# Altium schematic sheet Э3_2.SchDoc: плата
size 420 x 297 mm; DrawnBy: Каверзнев; DocumentNumber: Ремонт Труб; Revision: 1; SheetNumber: 1; SheetTotal: 2; Format: A3
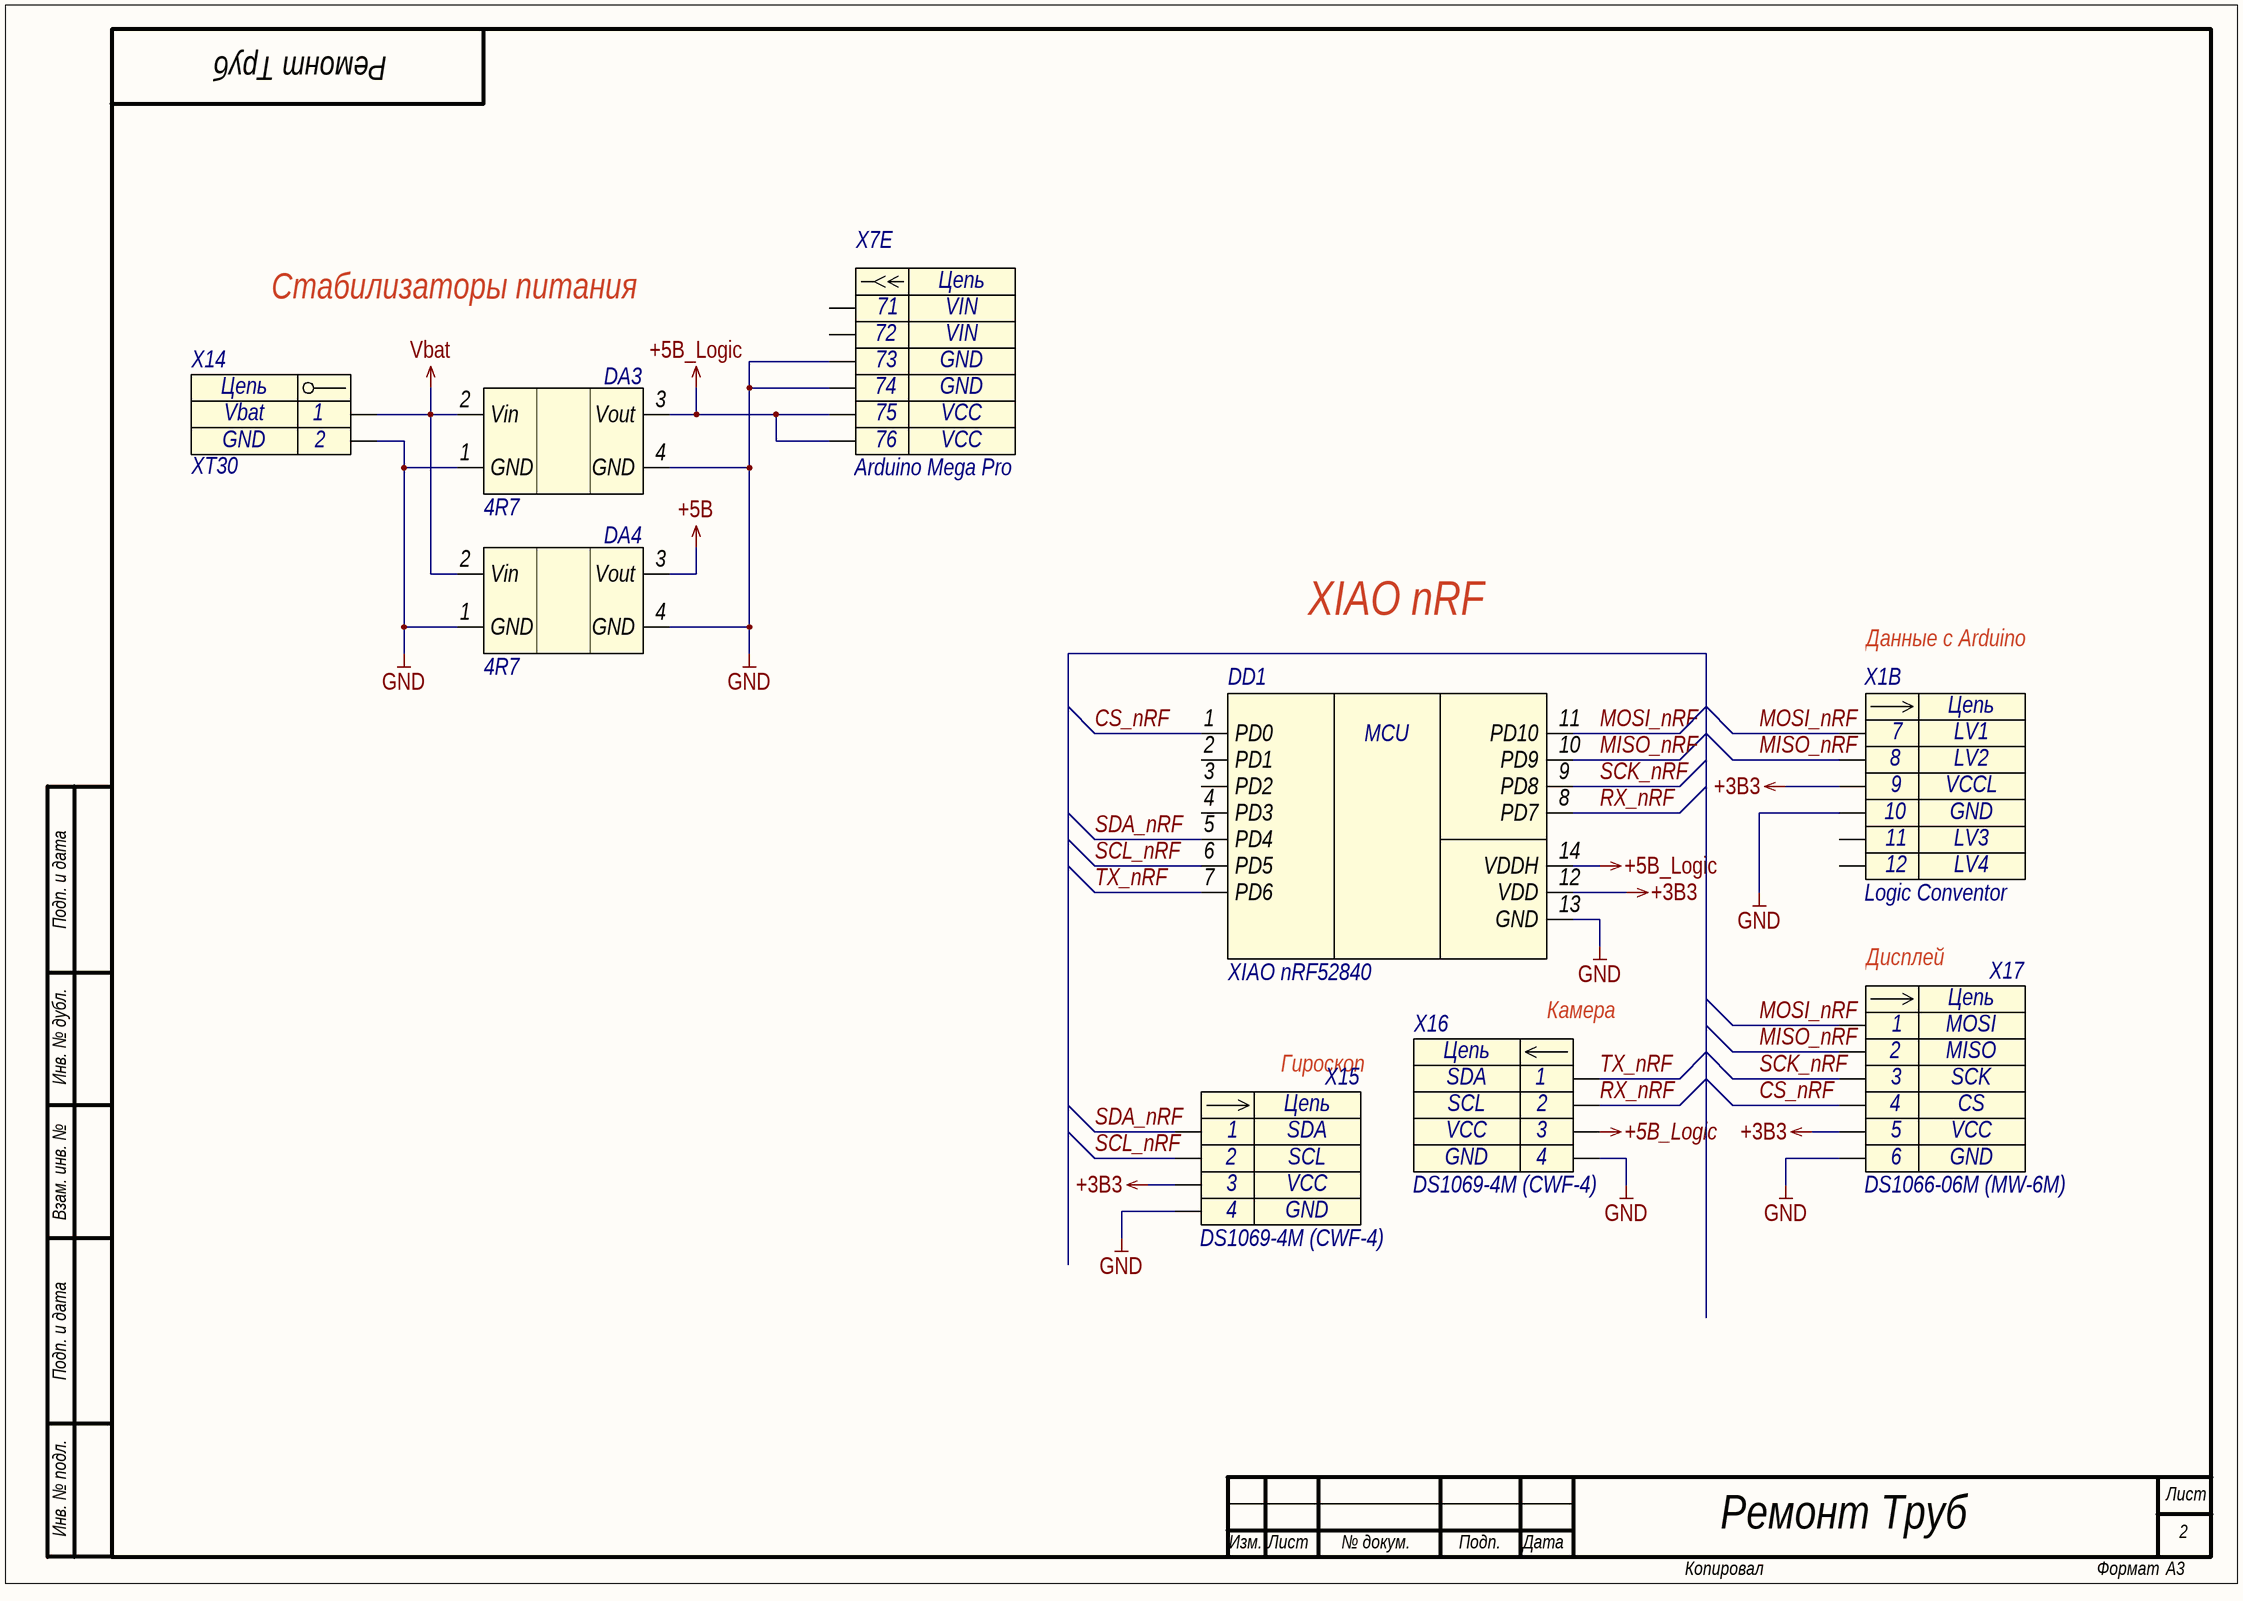
[diagram p0: Э3_2.SchDoc]

## Parts
DA3  4R7  [mini360]
DA4  4R7  [mini360]
DD1  XIAO nRF52840  [Seeed Studio XIAO nRF52840]
X1  Logic Conventor  [LOGIC CONVENTOR]  (part B of 2)
X7  Arduino Mega Pro  [Arduino Mega Pro Mini]  (part E of 5)
X14  XT30  [XT30 - duplicate]
X15  DS1069-4M (CWF-4)  [CWF-4]
X16  DS1069-4M (CWF-4)  [CWF-4]
X17  DS1066-06M (MW-6M)  [MW-6M]

## Nets
+3B3: DD1.12(VDD) X1.9 X15.3 X17.5
+5B: DA4.3(Vout)
+5B_Logic: DA3.3(Vout) DD1.14(VDDH) X7.75 X7.76 X16.3
GND: DA3.1(GND) DA3.4(GND) DA4.1(GND) DA4.4(GND) DD1.13(GND) X1.10 X7.73 X7.74 X14.2 X15.4 X16.4 X17.6
Vbat: DA3.2(Vin) DA4.2(Vin) X14.1
CS_nRF: DD1.1(PD0) X17.4
MISO_nRF: DD1.10(PD9) X1.8 X17.2
MOSI_nRF: DD1.11(PD10) X1.7 X17.1
RX_nRF: DD1.8(PD7) X16.2
SCK_nRF: DD1.9(PD8) X17.3
SCL_nRF: DD1.6(PD5) X15.2
SDA_nRF: DD1.5(PD4) X15.1
TX_nRF: DD1.7(PD6) X16.1

Not connected (* = marked no-connect by the designer): DD1 2(PD1) 3(PD2) 4(PD3); X1 11 12; X7 71 72

## Notes on the sheet
- Стабилизаторы питания
- XIAO nRF
- Данные с Arduino
- Подп. и дата
- Дисплей
- Инв. № дубл.
- Камера
- (near X15) Гироскоп
- Взам. инв. №
- Инв. № подл.
- Лист
- 2
- Изм.
- № докум.
- Подп.
- Дата
- Копировал
- Формат
- (in symbol Arduino Mega Pro Mini, part E) Цепь; VIN; GND; VCC
- (in symbol CWF-4) Цепь
- (in symbol Logic Conventor, part B) Цепь; LV1; LV2; VCCL; GND; LV3; LV4
- (in symbol MW-6M) Цепь
- (in symbol XIAO nRF52840) MCU
- (in symbol XT30) Цепь

## Library data of the parts
DA3 DA4 = 4R7: Линейный стабилизатор напряжения 14.4В -> 5В; Manufacturer: China; Name: 4R7
DD1 = XIAO nRF52840: Микроконтроллер nRF52840; Name: XIAO nRF52840; HelpURL: https://wiki.seeedstudio.com/XIAO_BLE/#hardware-overview
X1 = Logic Conventor: Преобразователь уровней; Name: Logic Conventor
X7 = Arduino Mega Pro Mini: Name: Arduino Mega Pro
X14 = XT30: Contact_1: Vbat; Contact_2: GND; Name: XT30
X15 X16 = CWF-4: Разъем - 4 конт. прямая вилка на плату; Contact_1: SDA; Contact_2: SCL; Contact_3: VCC; Contact_4: GND; Name: DS1069-4M (CWF-4)
X17 = MW-6M: Разъем - 6 конт. прямая вилка на плату; Contact_1: MOSI; Contact_2: MISO; Contact_3: SCK; Contact_4: CS; Contact_5: VCC; Contact_6: GND; Name: DS1066-06M (MW-6M)